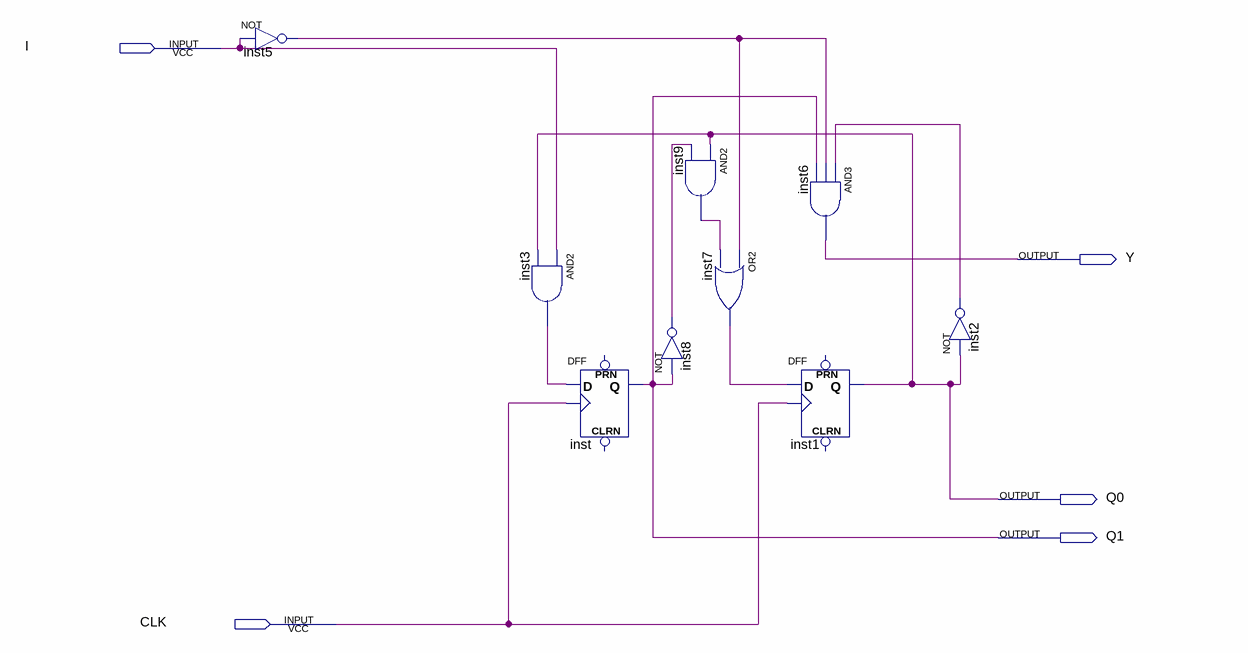
[diagram p0: schematic sheet]
// Quartus schematic MEALY_TYPE.bdf as structural Verilog: 9 symbols, 5 pins
module MEALY_TYPE (
  input  I,
  input  CLK,
  output Y,
  output Q0,
  output Q1
);

  wire inst2_out, inst3_out, inst5_out, inst7_out, inst8_out, inst9_out;

  not inst5 (inst5_out, I);
  and inst3 (inst3_out, I, Q0);
  DFF inst (.CLK(CLK), .D(inst3_out), .Q(Q1));  // open: CLRN, PRN
  and inst9 (inst9_out, Q0, inst8_out);
  or inst7 (inst7_out, inst5_out, inst9_out);
  not inst8 (inst8_out, Q1);
  DFF inst1 (.CLK(CLK), .D(inst7_out), .Q(Q0));  // open: CLRN, PRN
  and inst6 (Y, inst2_out, inst5_out, Q1);
  not inst2 (inst2_out, Q0);
endmodule
